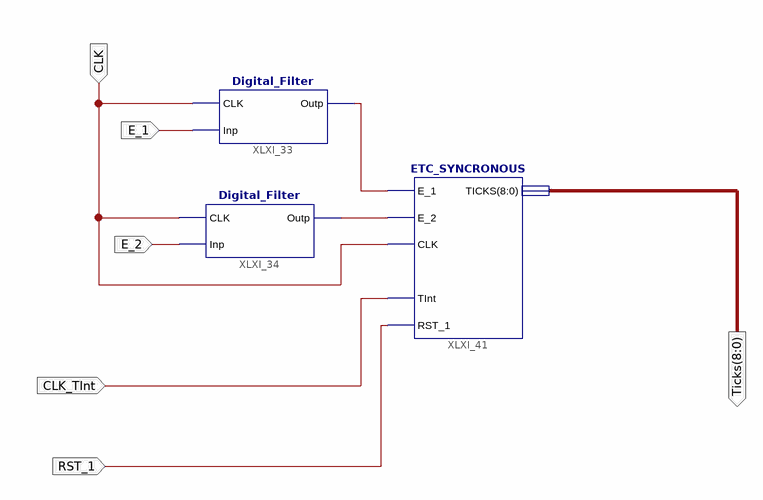
[diagram p0: schematic sheet 1]
// Xilinx ISE schematic Main_Module.sch (spartan3e) as structural Verilog: 3 symbols, 6 ports
module Main_Module (
  input  CLK,
  input  E_2,
  input  E_1,
  input  CLK_TInt,
  input  RST_1,
  output [8:0] Ticks
);

  wire XLXN_58, XLXN_59;

  Digital_Filter XLXI_33 (.CLK(CLK), .Inp(E_1), .Outp(XLXN_59));
  Digital_Filter XLXI_34 (.CLK(CLK), .Inp(E_2), .Outp(XLXN_58));
  ETC_SYNCRONOUS XLXI_41 (.E_1(XLXN_59), .E_2(XLXN_58), .CLK(CLK), .TICKS(Ticks), .TInt(CLK_TInt), .RST_1(RST_1));
endmodule
